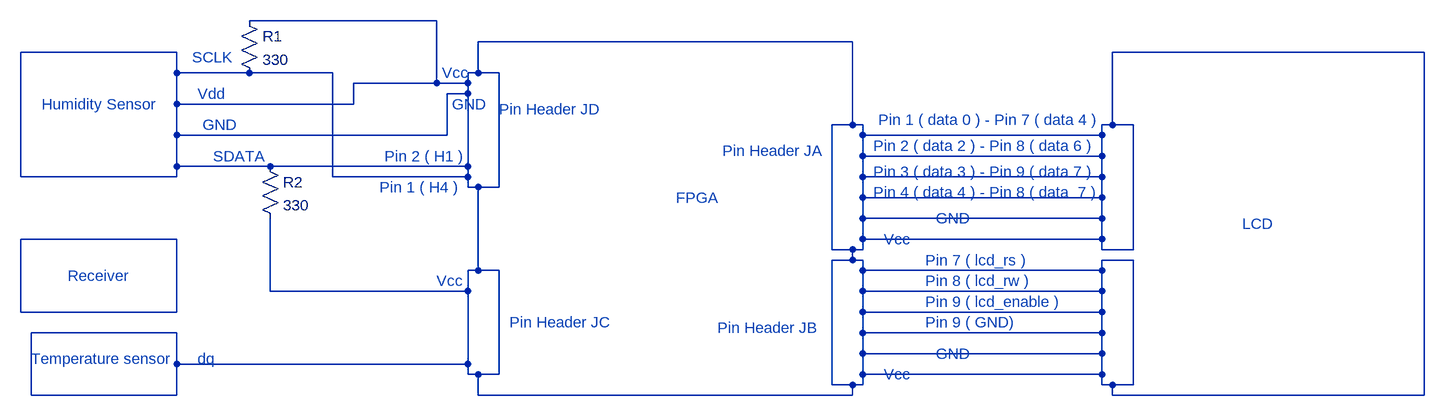
[diagram p0: schematic circuit_diagram.asc]
circuit_diagram.asc, the LTspice schematic file:
Version 4
SHEET 1 2196 680
WIRE 672 -112 384 -112
WIRE 1312 -80 736 -80
WIRE 272 -64 32 -64
WIRE 2192 -64 1712 -64
WIRE 272 -32 272 -64
WIRE 384 -32 272 -32
WIRE 512 -32 384 -32
WIRE 736 -32 736 -80
WIRE 736 -32 720 -32
WIRE 768 -32 736 -32
WIRE 672 -16 672 -112
WIRE 672 -16 544 -16
WIRE 720 -16 720 -32
WIRE 720 -16 672 -16
WIRE 720 0 720 -16
WIRE 720 0 688 0
WIRE 272 16 272 -32
WIRE 544 16 544 -16
WIRE 544 16 272 16
WIRE 1312 48 1312 -80
WIRE 1312 48 1280 48
WIRE 1328 48 1312 48
WIRE 1712 48 1712 -64
WIRE 1712 48 1696 48
WIRE 1744 48 1712 48
WIRE 272 64 272 16
WIRE 688 64 688 0
WIRE 688 64 272 64
WIRE 1328 64 1328 48
WIRE 1696 64 1696 48
WIRE 1696 64 1328 64
WIRE 1328 96 1328 64
WIRE 1696 96 1696 64
WIRE 1696 96 1328 96
WIRE 272 112 272 64
WIRE 416 112 272 112
WIRE 720 112 720 0
WIRE 720 112 416 112
WIRE 32 128 32 -64
WIRE 272 128 272 112
WIRE 272 128 32 128
WIRE 512 128 512 -32
WIRE 720 128 720 112
WIRE 720 128 512 128
WIRE 1328 128 1328 96
WIRE 1696 128 1696 96
WIRE 1696 128 1328 128
WIRE 720 144 720 128
WIRE 736 144 720 144
WIRE 768 144 768 -32
WIRE 768 144 736 144
WIRE 1328 160 1328 128
WIRE 1696 160 1696 128
WIRE 1696 160 1328 160
WIRE 1328 192 1328 160
WIRE 1696 192 1696 160
WIRE 1696 192 1328 192
WIRE 272 224 32 224
WIRE 1328 224 1328 192
WIRE 1696 224 1696 192
WIRE 1696 224 1328 224
WIRE 1280 240 1280 48
WIRE 1312 240 1280 240
WIRE 1328 240 1328 224
WIRE 1328 240 1312 240
WIRE 1696 240 1696 224
WIRE 1744 240 1744 48
WIRE 1744 240 1696 240
WIRE 1312 256 1312 240
WIRE 1312 256 1280 256
WIRE 1328 256 1312 256
WIRE 1744 256 1696 256
WIRE 736 272 736 144
WIRE 736 272 720 272
WIRE 768 272 736 272
WIRE 1328 272 1328 256
WIRE 1696 272 1696 256
WIRE 1696 272 1328 272
WIRE 416 304 416 192
WIRE 720 304 720 272
WIRE 720 304 416 304
WIRE 1328 304 1328 272
WIRE 1696 304 1696 272
WIRE 1696 304 1328 304
WIRE 32 336 32 224
WIRE 272 336 272 224
WIRE 272 336 32 336
WIRE 1328 336 1328 304
WIRE 1696 336 1696 304
WIRE 1696 336 1328 336
WIRE 272 368 48 368
WIRE 1328 368 1328 336
WIRE 1696 368 1696 336
WIRE 1696 368 1328 368
WIRE 1328 400 1328 368
WIRE 1696 400 1696 368
WIRE 1696 400 1328 400
WIRE 272 416 272 368
WIRE 720 416 720 304
WIRE 720 416 272 416
WIRE 720 432 720 416
WIRE 736 432 720 432
WIRE 768 432 768 272
WIRE 768 432 736 432
WIRE 1328 432 1328 400
WIRE 1696 432 1696 400
WIRE 1696 432 1328 432
WIRE 1280 448 1280 256
WIRE 1312 448 1280 448
WIRE 1328 448 1328 432
WIRE 1328 448 1312 448
WIRE 1696 448 1696 432
WIRE 1712 448 1696 448
WIRE 1744 448 1744 256
WIRE 1744 448 1712 448
WIRE 48 464 48 368
WIRE 272 464 272 416
WIRE 272 464 48 464
WIRE 736 464 736 432
WIRE 1312 464 1312 448
WIRE 1312 464 736 464
WIRE 1712 464 1712 448
WIRE 2192 464 2192 -64
WIRE 2192 464 1712 464
SYMBOL res 400 96 R0
SYMATTR InstName R2
SYMATTR Value 330
SYMBOL res 368 -128 R0
SYMATTR InstName R1
SYMATTR Value 330
TEXT 1040 160 Left 2 ;FPGA
TEXT 768 24 Left 2 ;Pin Header JD
TEXT 64 16 Left 2 ;Humidity Sensor
TEXT 296 -56 Left 2 ;SCLK
TEXT 328 96 Left 2 ;SDATA
TEXT 312 48 Left 2 ;GND
TEXT 304 0 Left 2 ;Vdd
TEXT 784 352 Left 2 ;Pin Header JC
TEXT 584 144 Left 2 ;Pin 1 ( H4 )
TEXT 592 96 Left 2 ;Pin 2 ( H1 )
TEXT 696 16 Left 2 ;GND
TEXT 680 -32 Left 2 ;Vcc
TEXT 672 288 Left 2 ;Vcc
TEXT 1912 200 Left 2 ;LCD
TEXT 48 408 Left 2 ;Temperature sensor
TEXT 104 280 Left 2 ;Receiver
TEXT 304 408 Left 2 ;dq
TEXT 1352 40 Left 2 ;Pin 1 ( data 0 ) - Pin 7 ( data 4 )
TEXT 1112 88 Left 2 ;Pin Header JA
TEXT 1440 192 Left 2 ;GND
TEXT 1360 224 Left 2 ;Vcc
TEXT 1344 152 Left 2 ;Pin 4 ( data 4 ) - Pin 8 ( data  7 )
TEXT 1344 120 Left 2 ;Pin 3 ( data 3 ) - Pin 9 ( data 7 )
TEXT 1344 80 Left 2 ;Pin 2 ( data 2 ) - Pin 8 ( data 6 )
TEXT 1424 256 Left 2 ;Pin 7 ( lcd_rs )
TEXT 1440 400 Left 2 ;GND
TEXT 1360 432 Left 2 ;Vcc
TEXT 1104 360 Left 2 ;Pin Header JB
TEXT 1424 288 Left 2 ;Pin 8 ( lcd_rw )
TEXT 1424 320 Left 2 ;Pin 9 ( lcd_enable )
TEXT 1424 352 Left 2 ;Pin 9 ( GND)

The netlist it stands for:
* circuit_diagram.asc
R2 N001 N001 330
R1 N001 N001 330
* FPGA
* Pin Header JD
* Humidity Sensor
* SCLK
* SDATA
* GND
* Vdd
* Pin Header JC
* Pin 1 ( H4 )
* Pin 2 ( H1 )
* GND
* Vcc
* Vcc
* LCD
* Temperature sensor
* Receiver
* dq
* Pin 1 ( data 0 ) - Pin 7 ( data 4 )
* Pin Header JA
* GND
* Vcc
* Pin 4 ( data 4 ) - Pin 8 ( data  7 )
* Pin 3 ( data 3 ) - Pin 9 ( data 7 )
* Pin 2 ( data 2 ) - Pin 8 ( data 6 )
* Pin 7 ( lcd_rs )
* GND
* Vcc
* Pin Header JB
* Pin 8 ( lcd_rw )
* Pin 9 ( lcd_enable )
* Pin 9 ( GND)
.backanno
.end